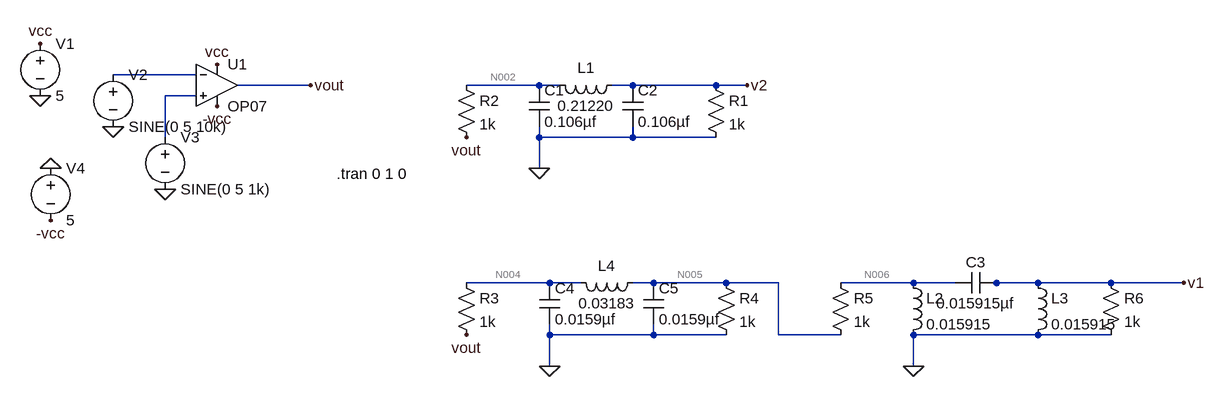
[diagram p0: schematic Draft2.asc]
Draft2.asc, the LTspice schematic file:
Version 4
SHEET 1 1676 680
WIRE 112 128 -16 128
WIRE 288 144 176 144
WIRE 640 144 528 144
WIRE 672 144 640 144
WIRE 784 144 752 144
WIRE 912 144 784 144
WIRE 960 144 912 144
WIRE 112 160 64 160
WIRE 64 224 64 160
WIRE 640 224 640 208
WIRE 784 224 784 208
WIRE 784 224 640 224
WIRE 912 224 784 224
WIRE 640 272 640 224
WIRE 656 448 528 448
WIRE 704 448 656 448
WIRE 816 448 784 448
WIRE 928 448 816 448
WIRE 1008 448 928 448
WIRE 1216 448 1104 448
WIRE 1280 448 1216 448
WIRE 1344 448 1328 448
WIRE 1408 448 1344 448
WIRE 1520 448 1408 448
WIRE 1632 448 1520 448
WIRE 656 528 656 512
WIRE 816 528 816 512
WIRE 816 528 656 528
WIRE 928 528 816 528
WIRE 1008 528 1008 448
WIRE 1104 528 1008 528
WIRE 1408 528 1216 528
WIRE 1520 528 1408 528
WIRE 656 576 656 528
WIRE 1216 576 1216 528
FLAG -128 80 vcc
FLAG 144 112 vcc
FLAG -16 208 0
FLAG 64 304 0
FLAG -128 160 0
FLAG 288 144 vout
FLAG -112 272 0
FLAG 144 176 -vcc
FLAG -112 352 -vcc
FLAG 528 224 vout
FLAG 960 144 v2
FLAG 640 272 0
FLAG 1216 576 0
FLAG 656 576 0
FLAG 1632 448 v1
FLAG 528 528 vout
SYMBOL OpAmps\\OP07 144 80 R0
SYMATTR InstName U1
SYMBOL voltage -128 64 R0
WINDOW 123 0 0 Left 0
WINDOW 39 0 0 Left 0
SYMATTR InstName V1
SYMATTR Value 5
SYMBOL voltage -16 112 R0
WINDOW 123 0 0 Left 0
WINDOW 39 0 0 Left 0
SYMATTR InstName V2
SYMATTR Value SINE(0 5 10k)
SYMBOL voltage 64 208 R0
WINDOW 123 0 0 Left 0
WINDOW 39 0 0 Left 0
SYMATTR InstName V3
SYMATTR Value SINE(0 5 1k)
SYMBOL voltage -112 256 R0
WINDOW 123 0 0 Left 0
WINDOW 39 0 0 Left 0
SYMATTR InstName V4
SYMATTR Value 5
SYMBOL cap 624 144 R0
SYMATTR InstName C1
SYMATTR Value 0.106µf
SYMBOL cap 768 144 R0
SYMATTR InstName C2
SYMATTR Value 0.106µf
SYMBOL res 896 128 R0
SYMATTR InstName R1
SYMATTR Value 1k
SYMBOL res 512 128 R0
SYMATTR InstName R2
SYMATTR Value 1k
SYMBOL ind 768 128 R90
WINDOW 0 5 56 VBottom 2
WINDOW 3 32 56 VTop 2
SYMATTR InstName L1
SYMATTR Value 0.21220
SYMBOL res 512 432 R0
SYMATTR InstName R3
SYMATTR Value 1k
SYMBOL res 912 432 R0
SYMATTR InstName R4
SYMATTR Value 1k
SYMBOL res 1088 432 R0
SYMATTR InstName R5
SYMATTR Value 1k
SYMBOL res 1504 432 R0
SYMATTR InstName R6
SYMATTR Value 1k
SYMBOL ind 1200 432 R0
SYMATTR InstName L2
SYMATTR Value 0.015915
SYMBOL ind 1392 432 R0
SYMATTR InstName L3
SYMATTR Value 0.015915
SYMBOL cap 1344 432 R90
WINDOW 0 0 32 VBottom 2
WINDOW 3 32 32 VTop 2
SYMATTR InstName C3
SYMATTR Value 0.015915µf
SYMBOL cap 640 448 R0
SYMATTR InstName C4
SYMATTR Value 0.0159µf
SYMBOL cap 800 448 R0
SYMATTR InstName C5
SYMATTR Value 0.0159µf
SYMBOL ind 800 432 R90
WINDOW 0 5 56 VBottom 2
WINDOW 3 32 56 VTop 2
SYMATTR InstName L4
SYMATTR Value 0.03183
TEXT 328 280 Left 2 !.tran 0 1 0

The netlist it stands for:
* Draft2.asc
XU1 N003 N001 vcc -vcc vout LT1001  ; OP07, pins In+ In- V+ V- OUT
V1 vcc 0 5
V2 N001 0 SINE(0 5 10k)
V3 N003 0 SINE(0 5 1k)
V4 0 -vcc 5
C1 N002 0 0.106µf
C2 v2 0 0.106µf
R1 v2 0 1k
R2 N002 vout 1k
L1 v2 N002 0.21220
R3 N004 vout 1k
R4 N005 0 1k
R5 N006 N005 1k
R6 v1 0 1k
L2 N006 0 0.015915
L3 v1 0 0.015915
C3 v1 N006 0.015915µf
C4 N004 0 0.0159µf
C5 N005 0 0.0159µf
L4 N005 N004 0.03183
.tran 0 1 0
.lib LTC.lib
.backanno
.end

* Results of the author's LTspice run, read from the files saved beside the schematic
* Operating Point, zero values left out:
*   V(vcc) = 5 V
*   V(-vcc) = -5 V
*   V(vout) = -3.895 V
*   V(n002) = -1.948 V
*   V(v2) = -1.948 V
*   V(n004) = -1.298 V
*   V(n005) = -1.298 V
*   V(n006) = -1.298 µV
*   I(L1) = 1.948 mA
*   I(L2) = -1.298 mA
*   I(L4) = 2.597 mA
*   I(R1) = -1.948 mA
*   I(R2) = 1.948 mA
*   I(R3) = 2.597 mA
*   I(R4) = -1.298 mA
*   I(R5) = 1.298 mA
*   I(V1) = -551.5 µA
*   I(V4) = -5.096 mA
*   Ix(u1:3) = 551.5 µA
*   Ix(u1:4) = -5.096 mA
*   Ix(u1:5) = 4.544 mA